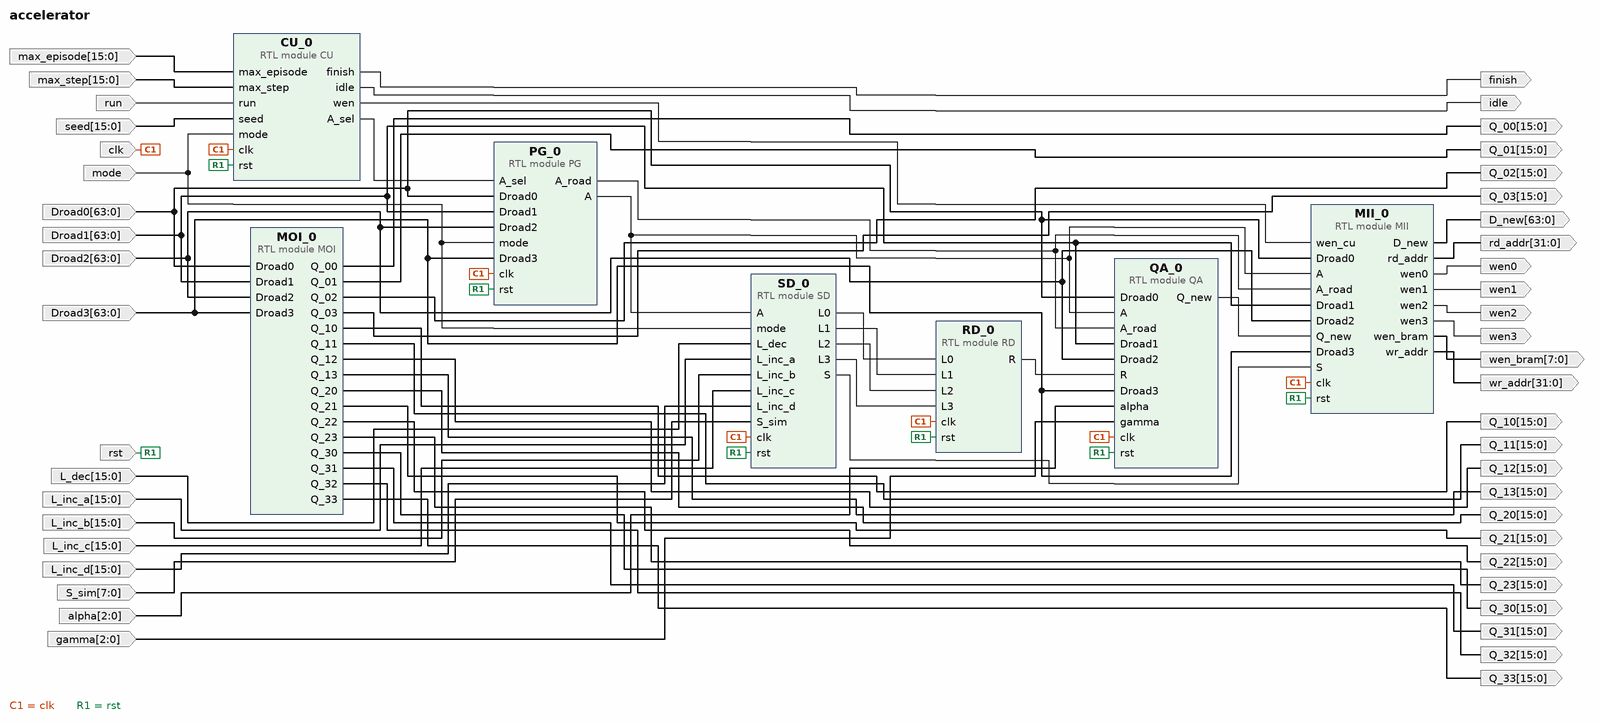
[diagram p0: block diagram of the top level]
# Vivado block design accelerator, xc7z020clg400-1, Vivado 2022.1
create_bd_design accelerator

create_bd_port -dir O -from 63 -to 0 D_new
create_bd_port -dir I -from 63 -to 0 Droad0
create_bd_port -dir I -from 63 -to 0 Droad1
create_bd_port -dir I -from 63 -to 0 Droad2
create_bd_port -dir I -from 63 -to 0 Droad3
create_bd_port -dir I -from 15 -to 0 L_dec
create_bd_port -dir I -from 15 -to 0 L_inc_a
create_bd_port -dir I -from 15 -to 0 L_inc_b
create_bd_port -dir I -from 15 -to 0 L_inc_c
create_bd_port -dir I -from 15 -to 0 L_inc_d
create_bd_port -dir O -from 15 -to 0 Q_00
create_bd_port -dir O -from 15 -to 0 Q_01
create_bd_port -dir O -from 15 -to 0 Q_02
create_bd_port -dir O -from 15 -to 0 Q_03
create_bd_port -dir O -from 15 -to 0 Q_10
create_bd_port -dir O -from 15 -to 0 Q_11
create_bd_port -dir O -from 15 -to 0 Q_12
create_bd_port -dir O -from 15 -to 0 Q_13
create_bd_port -dir O -from 15 -to 0 Q_20
create_bd_port -dir O -from 15 -to 0 Q_21
create_bd_port -dir O -from 15 -to 0 Q_22
create_bd_port -dir O -from 15 -to 0 Q_23
create_bd_port -dir O -from 15 -to 0 Q_30
create_bd_port -dir O -from 15 -to 0 Q_31
create_bd_port -dir O -from 15 -to 0 Q_32
create_bd_port -dir O -from 15 -to 0 Q_33
create_bd_port -dir I -from 7 -to 0 S_sim
create_bd_port -dir I -from 2 -to 0 alpha
create_bd_port -dir I -type clk clk
set_property -dict {CONFIG.FREQ_HZ 58823528} [get_bd_ports clk]
create_bd_port -dir O finish
create_bd_port -dir I -from 2 -to 0 gamma
create_bd_port -dir O idle
create_bd_port -dir I -from 15 -to 0 max_episode
create_bd_port -dir I -from 15 -to 0 max_step
create_bd_port -dir I mode
create_bd_port -dir O -from 31 -to 0 rd_addr
create_bd_port -dir I -type rst rst
set_property -dict {CONFIG.POLARITY ACTIVE_HIGH} [get_bd_ports rst]
create_bd_port -dir I run
create_bd_port -dir I -from 15 -to 0 seed
create_bd_port -dir O wen0
create_bd_port -dir O wen1
create_bd_port -dir O wen2
create_bd_port -dir O wen3
create_bd_port -dir O -from 7 -to 0 wen_bram
create_bd_port -dir O -from 31 -to 0 wr_addr

create_bd_cell -type module -reference CU CU_0
create_bd_cell -type module -reference MII MII_0
create_bd_cell -type module -reference MOI MOI_0
create_bd_cell -type module -reference QA QA_0
create_bd_cell -type module -reference SD SD_0
set_property -dict {CONFIG.L_WIDTH 4} [get_bd_cells SD_0]
create_bd_cell -type module -reference PG PG_0
set_property -dict {CONFIG.L_WIDTH 4} [get_bd_cells PG_0]
create_bd_cell -type module -reference RD RD_0

# ---- connections ----

connect_bd_net [get_bd_pins CU_0/A_sel] [get_bd_pins PG_0/A_sel]
connect_bd_net [get_bd_pins CU_0/finish] [get_bd_ports finish]
connect_bd_net [get_bd_pins CU_0/idle] [get_bd_ports idle]
connect_bd_net [get_bd_pins CU_0/wen] [get_bd_pins MII_0/wen_cu]
connect_bd_net -net MII_0_Dnew [get_bd_pins MII_0/D_new] [get_bd_ports D_new]
connect_bd_net [get_bd_pins MII_0/rd_addr] [get_bd_ports rd_addr]
connect_bd_net [get_bd_pins MII_0/wr_addr] [get_bd_ports wr_addr]
connect_bd_net -net MII_0_en0 [get_bd_pins MII_0/wen0] [get_bd_ports wen0]
connect_bd_net -net MII_0_en1 [get_bd_pins MII_0/wen1] [get_bd_ports wen1]
connect_bd_net -net MII_0_en2 [get_bd_pins MII_0/wen2] [get_bd_ports wen2]
connect_bd_net -net MII_0_en3 [get_bd_pins MII_0/wen3] [get_bd_ports wen3]
connect_bd_net [get_bd_pins MII_0/wen_bram] [get_bd_ports wen_bram]
connect_bd_net [get_bd_pins MOI_0/Q_00] [get_bd_ports Q_00]
connect_bd_net [get_bd_pins MOI_0/Q_01] [get_bd_ports Q_01]
connect_bd_net [get_bd_pins MOI_0/Q_02] [get_bd_ports Q_02]
connect_bd_net [get_bd_pins MOI_0/Q_03] [get_bd_ports Q_03]
connect_bd_net [get_bd_pins MOI_0/Q_10] [get_bd_ports Q_10]
connect_bd_net [get_bd_pins MOI_0/Q_11] [get_bd_ports Q_11]
connect_bd_net [get_bd_pins MOI_0/Q_12] [get_bd_ports Q_12]
connect_bd_net [get_bd_pins MOI_0/Q_13] [get_bd_ports Q_13]
connect_bd_net [get_bd_pins MOI_0/Q_20] [get_bd_ports Q_20]
connect_bd_net [get_bd_pins MOI_0/Q_21] [get_bd_ports Q_21]
connect_bd_net [get_bd_pins MOI_0/Q_22] [get_bd_ports Q_22]
connect_bd_net [get_bd_pins MOI_0/Q_23] [get_bd_ports Q_23]
connect_bd_net [get_bd_pins MOI_0/Q_30] [get_bd_ports Q_30]
connect_bd_net [get_bd_pins MOI_0/Q_31] [get_bd_ports Q_31]
connect_bd_net [get_bd_pins MOI_0/Q_32] [get_bd_ports Q_32]
connect_bd_net [get_bd_pins MOI_0/Q_33] [get_bd_ports Q_33]
connect_bd_net [get_bd_pins PG_0/A] [get_bd_pins QA_0/A] [get_bd_pins SD_0/A] [get_bd_pins MII_0/A]
connect_bd_net [get_bd_pins PG_0/A_road] [get_bd_pins QA_0/A_road] [get_bd_pins MII_0/A_road]
connect_bd_net [get_bd_pins QA_0/Q_new] [get_bd_pins MII_0/Q_new]
connect_bd_net [get_bd_pins RD_0/R] [get_bd_pins QA_0/R]
connect_bd_net [get_bd_pins SD_0/L0] [get_bd_pins RD_0/L0]
connect_bd_net [get_bd_pins SD_0/L1] [get_bd_pins RD_0/L1]
connect_bd_net [get_bd_pins SD_0/L2] [get_bd_pins RD_0/L2]
connect_bd_net [get_bd_pins SD_0/L3] [get_bd_pins RD_0/L3]
connect_bd_net [get_bd_pins SD_0/S] [get_bd_pins MII_0/S]
connect_bd_net -net action_ram_wrapper_0_Droad0 [get_bd_ports Droad0] \
  [get_bd_pins QA_0/Droad0] [get_bd_pins MOI_0/Droad0] [get_bd_pins MII_0/Droad0] [get_bd_pins PG_0/Droad0]
connect_bd_net -net action_ram_wrapper_0_Droad1 [get_bd_ports Droad1] \
  [get_bd_pins QA_0/Droad1] [get_bd_pins MOI_0/Droad1] [get_bd_pins MII_0/Droad1] [get_bd_pins PG_0/Droad1]
connect_bd_net -net action_ram_wrapper_0_Droad2 [get_bd_ports Droad2] \
  [get_bd_pins QA_0/Droad2] [get_bd_pins MOI_0/Droad2] [get_bd_pins MII_0/Droad2] [get_bd_pins PG_0/Droad2]
connect_bd_net -net action_ram_wrapper_0_Droad3 [get_bd_ports Droad3] \
  [get_bd_pins QA_0/Droad3] [get_bd_pins MOI_0/Droad3] [get_bd_pins MII_0/Droad3] [get_bd_pins PG_0/Droad3]
connect_bd_net -net clk_wiz_clk_out1 [get_bd_ports clk] \
  [get_bd_pins CU_0/clk] [get_bd_pins QA_0/clk] [get_bd_pins SD_0/clk] [get_bd_pins MII_0/clk] [get_bd_pins PG_0/clk] \
  [get_bd_pins RD_0/clk]
connect_bd_net -net intellight_database_0_L_dec [get_bd_ports L_dec] [get_bd_pins SD_0/L_dec]
connect_bd_net -net intellight_database_0_L_inc_a [get_bd_ports L_inc_a] [get_bd_pins SD_0/L_inc_a]
connect_bd_net -net intellight_database_0_L_inc_b [get_bd_ports L_inc_b] [get_bd_pins SD_0/L_inc_b]
connect_bd_net -net intellight_database_0_L_inc_c [get_bd_ports L_inc_c] [get_bd_pins SD_0/L_inc_c]
connect_bd_net -net intellight_database_0_L_inc_d [get_bd_ports L_inc_d] [get_bd_pins SD_0/L_inc_d]
connect_bd_net -net intellight_database_0_S_sim [get_bd_ports S_sim] [get_bd_pins SD_0/S_sim]
connect_bd_net -net intellight_database_0_alpha [get_bd_ports alpha] [get_bd_pins QA_0/alpha]
connect_bd_net -net intellight_database_0_gamma [get_bd_ports gamma] [get_bd_pins QA_0/gamma]
connect_bd_net -net intellight_database_0_max_episode [get_bd_ports max_episode] [get_bd_pins CU_0/max_episode]
connect_bd_net -net intellight_database_0_max_step [get_bd_ports max_step] [get_bd_pins CU_0/max_step]
connect_bd_net -net intellight_database_0_mode [get_bd_ports mode] [get_bd_pins CU_0/mode] [get_bd_pins SD_0/mode] [get_bd_pins PG_0/mode]
connect_bd_net -net intellight_database_0_run [get_bd_ports run] [get_bd_pins CU_0/run]
connect_bd_net -net intellight_database_0_seed [get_bd_ports seed] [get_bd_pins CU_0/seed]
connect_bd_net -net rst_ps7_0_100M_peripheral_aresetn [get_bd_ports rst] \
  [get_bd_pins CU_0/rst] [get_bd_pins QA_0/rst] [get_bd_pins SD_0/rst] [get_bd_pins MII_0/rst] [get_bd_pins PG_0/rst] \
  [get_bd_pins RD_0/rst]

validate_bd_design
save_bd_design
